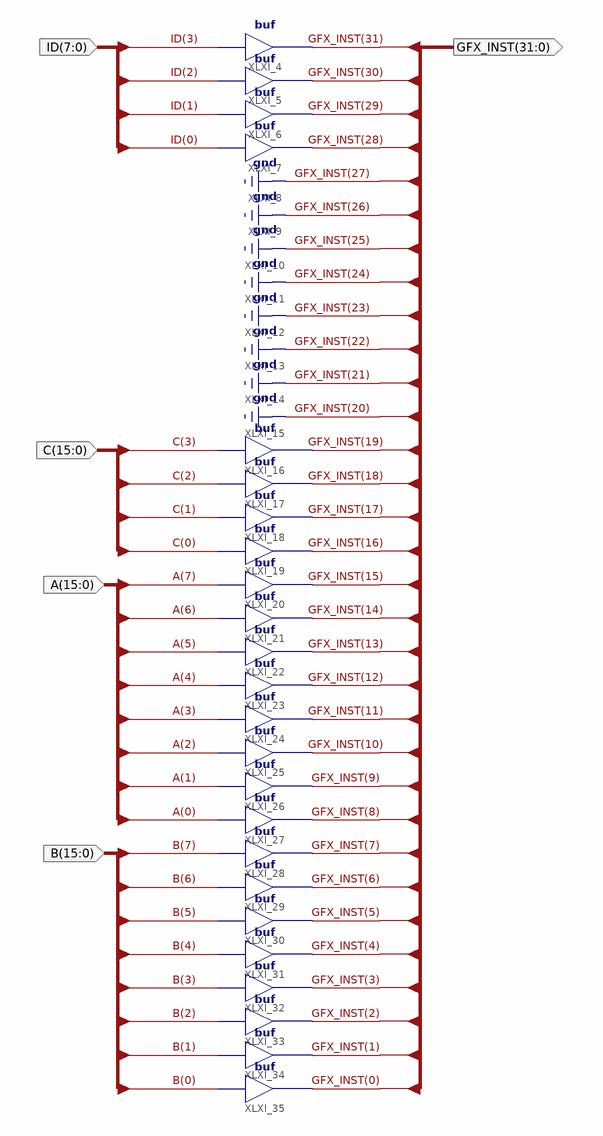
[diagram p0: schematic sheet 1]
// Xilinx ISE schematic gfx_inst_encoder.sch (spartan6) as structural Verilog: 24 symbols, 5 ports
module gfx_inst_encoder (
  input  [7:0] ID,
  input  [15:0] C,
  input  [15:0] A,
  input  [15:0] B,
  output [31:0] GFX_INST
);

  buf XLXI_4 (GFX_INST[31], ID[3]);
  buf XLXI_5 (GFX_INST[30], ID[2]);
  buf XLXI_6 (GFX_INST[29], ID[1]);
  buf XLXI_7 (GFX_INST[28], ID[0]);
  buf XLXI_16 (GFX_INST[19], C[3]);
  buf XLXI_17 (GFX_INST[18], C[2]);
  buf XLXI_18 (GFX_INST[17], C[1]);
  buf XLXI_19 (GFX_INST[16], C[0]);
  buf XLXI_20 (GFX_INST[15], A[7]);
  buf XLXI_21 (GFX_INST[14], A[6]);
  buf XLXI_22 (GFX_INST[13], A[5]);
  buf XLXI_23 (GFX_INST[12], A[4]);
  buf XLXI_24 (GFX_INST[11], A[3]);
  buf XLXI_25 (GFX_INST[10], A[2]);
  buf XLXI_26 (GFX_INST[9], A[1]);
  buf XLXI_27 (GFX_INST[8], A[0]);
  buf XLXI_28 (GFX_INST[7], B[7]);
  buf XLXI_29 (GFX_INST[6], B[6]);
  buf XLXI_30 (GFX_INST[5], B[5]);
  buf XLXI_31 (GFX_INST[4], B[4]);
  buf XLXI_32 (GFX_INST[3], B[3]);
  buf XLXI_33 (GFX_INST[2], B[2]);
  buf XLXI_34 (GFX_INST[1], B[1]);
  buf XLXI_35 (GFX_INST[0], B[0]);

  assign GFX_INST[27:20] = {8{1'b0}};
endmodule
